# Altium schematic sheet Amplifier_PH.SchDoc
size A4; SheetNumber: 2; SheetTotal: 4
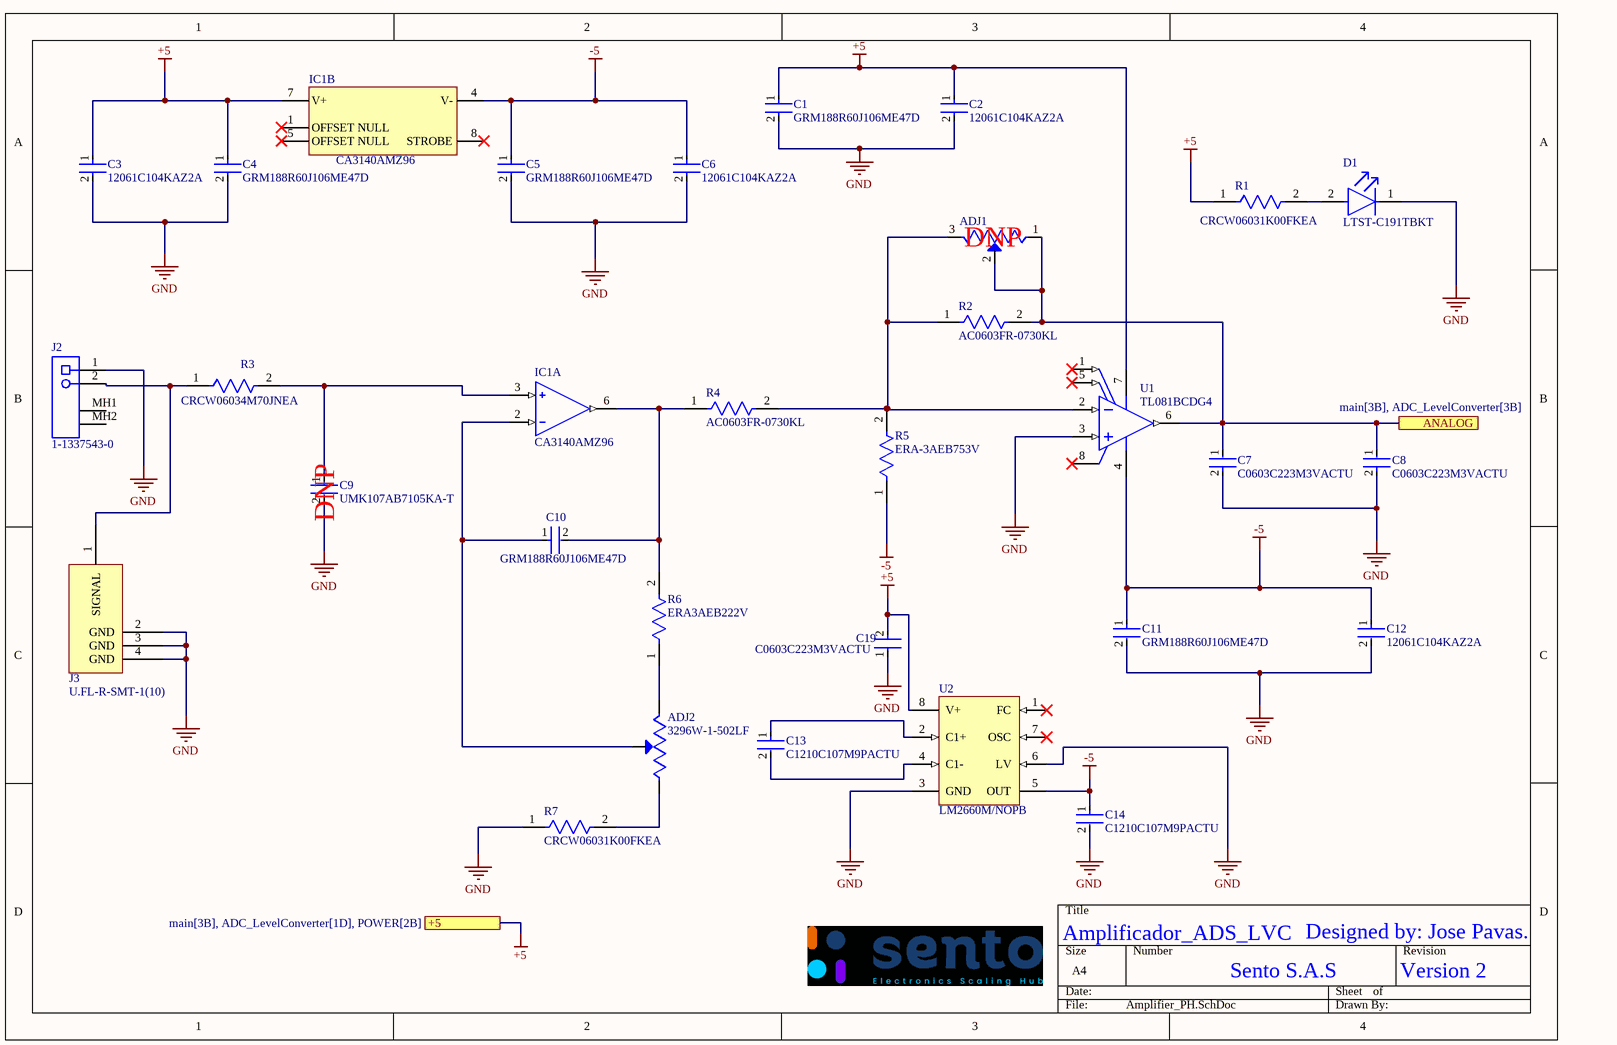
[diagram p0: Amplifier_PH.SchDoc]

## Parts
ADJ1  (no value)  [TRIM_3296W-1-502LF]
ADJ2  3296W-1-502LF  [TRIM_3296W-1-502LF]
C1  GRM188R60J106ME47D  [FP-GRM188-0_1-e0_2_0_55-IPC_A]
C2  12061C104KAZ2A  [FP-1206-L_3_2_0_2-W_1_6_0-MFG]
C3  12061C104KAZ2A  [FP-1206-L_3_2_0_2-W_1_6_0-MFG]
C4  GRM188R60J106ME47D  [FP-GRM188-0_1-e0_2_0_55-IPC_A]
C5  GRM188R60J106ME47D  [FP-GRM188-0_1-e0_2_0_55-IPC_A]
C6  12061C104KAZ2A  [FP-1206-L_3_2_0_2-W_1_6_0-MFG]
C7  C0603C223M3VACTU  [FP-CGA3E-0_3-0_1-MFG]
C8  C0603C223M3VACTU  [FP-CGA3E-0_3-0_1-MFG]
C9  UMK107AB7105KA-T  [FP-0603-L_1_6_0_15-W_0_8-IPC_C]
C10  GRM188R60J106ME47D  [FP-GRM188-0_1-e0_2_0_55-IPC_A]
C11  GRM188R60J106ME47D  [FP-GRM188-0_1-e0_2_0_55-IPC_A]
C12  12061C104KAZ2A  [FP-1206-L_3_2_0_2-W_1_6_0-MFG]
C13  C1210C107M9PACTU  [FP-C1210C107M9PACTU-MFG]
C14  C1210C107M9PACTU  [FP-C1210C107M9PACTU-MFG]
C19  C0603C223M3VACTU  [FP-CGA3E-0_3-0_1-MFG]
D1  LTST-C191TBKT  [FP-LTST-C191TBKT-MFG]
IC1  CA3140AMZ96  [SOIC127P600X175-8N]  (parts A,B of 2)
J2  1-1337543-0  [TECO-1-1337543-0_V]
J3  U.FL-R-SMT-1(10)  [0734120110]
R1  CRCW06031K00FKEA  [FP-CRCW0603-e3-MFG]
R2  AC0603FR-0730KL  [FP-AC0603-IPC_C]
R3  CRCW06034M70JNEA  [FP-CRCW0603-e3-MFG]
R4  AC0603FR-0730KL  [FP-AC0603-IPC_C]
R5  ERA-3AEB753V  [FP-ERA3A-MFG]
R6  ERA3AEB222V  [FP-ERA3A-MFG]
R7  CRCW06031K00FKEA  [FP-CRCW0603-e3-MFG]
U1  TL081BCDG4  [TI-D8_M]
U2  LM2660M/NOPB  [D0008A_M]

## Ports
+5 (see main[3B], ADC_LevelConverter[1D], POWER[2B]), ANALOG (see main[3B], ADC_LevelConverter[3B])

## Nets
+5: C1.1 C2.1 C3.1 C4.1 C19.2 IC1.7(V+) R1.1 U1.7(VCC+) U2.8(V+) ; port +5
-5: C5.1 C6.1 C11.1 C12.1 C14.1 IC1.4(V-) R5.1 U1.4(VCC-) U2.5(OUT)
GND: C1.2 C2.2 C3.2 C4.2 C5.2 C6.2 C7.2 C8.2 C9.2 C11.2 C12.2 C14.2 C19.1 D1.1(C) J2.1 J3.2(GND) J3.3(GND) J3.4(GND) R7.1 U1.3(IN+) U2.3(GND) U2.6(LV)
ANALOG: ADJ1.1(CCW) ADJ1.2(WIPER) C7.1 C8.1 R2.2 U1.6(OUT) ; port ANALOG
NetADJ1_3: ADJ1.3(CW) R2.1 R4.2 R5.2 U1.2(IN-)
NetADJ2_1: ADJ2.1(CCW) R7.2
NetADJ2_2: ADJ2.2(WIPER) C10.1 IC1.2(INV_INPUT)
NetADJ2_3: ADJ2.3(CW) R6.1
NetC9_1: C9.1 IC1.3(NON-INV_INPUT) R3.2
NetC10_2: C10.2 IC1.6(OUTPUT) R4.1 R6.2
NetC13_1: C13.1 U2.2(C1+)
NetC13_2: C13.2 U2.4(C1-)
NetD1_2: D1.2(A) R1.2
NetJ2_2: J2.2 J3.1(SIGNAL) R3.1

Not connected (* = marked no-connect by the designer): IC1 1(OFFSET_NULL)* 5(OFFSET_NULL)* 8(STROBE)*; J2 MH1 MH2; U1 1(OFFSET_N1)* 5(OFFSET_N2)* 8(NC)*; U2 1(FC)* 7(OSC)*

## Notes on the sheet
- (near ADJ1) DNP
- (near C9) DNP
- Amplificador_ADS_LVC
- Sento S.A.S
- Designed by: Jose Pavas.
- Version 2

## Library data of the parts
ADJ1 = 3296W-1-502LF: 100 kOhms 0.5W, 1/2W PC Pins Through Hole Trimmer Potentiometer Cermet 25.0 Turn Top Adjustment; MF: Bourns; Value: 100k; SnapEDA_Link: https://www.snapeda.com/parts/3296W-1-502LF/Bourns/view-part/?ref=snap; MP: 3296W-1-502LF; Price: None; Package: SOT-23-5 Bourns; Check_prices: https://www.snapeda.com/parts/3296W-1-502LF/Bourns/view-part/?ref=eda; Purchase-URL: https://pricing.snapeda.com/search/part/3296W-1-502LF/?ref=eda; Availability: In Stock; ComponentLink1Description: MOUSER; ComponentLink1URL: https://co.mouser.com/ProductDetail/Bourns/3296W-1-104ALF?qs=PYWKc%252BkzmhnUybN0QggnnQ%3D%3D; Supplier 1: Digikey; Supplier Part Number 1: 3296W-502LF-ND; LCSC Part Number: C48084
ADJ2 = 3296W-1-502LF: 5 kOhms 0.5W, 1/2W PC Pins Through Hole Trimmer Potentiometer Cermet 25.0 Turn Top Adjustment; MF: Bourns; Value: 5k; SnapEDA_Link: https://www.snapeda.com/parts/3296W-1-502LF/Bourns/view-part/?ref=snap; MP: 3296W-1-502LF; Price: None; Package: SOT-23-5 Bourns; Check_prices: https://www.snapeda.com/parts/3296W-1-502LF/Bourns/view-part/?ref=eda; Purchase-URL: https://pricing.snapeda.com/search/part/3296W-1-502LF/?ref=eda; Availability: In Stock; ComponentLink1Description: MOUSER; ComponentLink1URL: https://co.mouser.com/ProductDetail/Bourns/3296W-1-502LF?qs=zl1BDXJPZVrTnesl5BcuCQ%3D%3D; Supplier 1: Digikey; Supplier Part Number 1: 3296W-502LF-ND; LCSC Part Number: C60620
C1 C4 C5 C10 C11 = CMP-2006-02792-2: Chip Multilayer Ceramic Capacitors for General Purpose, 0603, 10uF, X5R, 15%, 20%, 6.3V; Packaging: Tape and Reel; Voltage Rating (DC): 6.3V; Width: 0.031inch; Termination: SMD/SMT; Dielectric: X5R; Package Quantity: 4000; Voltage Rating: 6.3V; Capacitance: 10uF; Case/Package: 0603; Min Operating Temperature: -55°C; Voltage: 6.3V; Length: 1.6mm; Thickness: 0.035inch; Lead Free: Lead Free; Depth: 0.8mm; Case Code (Imperial): 0603; Max Operating Temperature: 85°C; Material: Ceramic; Height: 0.8mm; Tolerance: 20%; Mount: Surface Mount; REACH SVHC: No SVHC; Radiation Hardening: No; Case Code (Metric): 1608; LCSC Part Number: C19702
  C1 C4 C5: ComponentLink1Description: MOUSER; ComponentLink1URL: https://co.mouser.com/ProductDetail/Murata-Electronics/GRM188R60J106ME47D?qs=5VWgUag8BO1qcafxYhmP3g%3D%3D
C2 C3 C6 C12 = CMP-04427-004798-1: General Purpose Ceramic Capacitor, 1206, 100nF, 10%, X7R, 15%, 100V; Features: Soft Termination; Termination: SMD/SMT; Mount: Surface Mount; Tolerance: 10%; Voltage Rating: 100V; Length: 3.2mm; Case/Package: 1206; Case Code (Metric): 3216; RoHS Compliant: Yes; Package Quantity: 1; Max Operating Temperature: 125°C; Voltage Rating (DC): 100V; Min Operating Temperature: -55°C; Number of Pins: 2; Packaging: Tape and Reel; Width: 0.063inch; REACH SVHC: No SVHC; Lead Free: Lead Free; Construction: Flat; Capacitance: 100nF; Radiation Hardening: No; Case Code (Imperial): 1206; Thickness: 0.05inch; Series: FLEXITERM®; Depth: 1.6mm; Dielectric: X7R; ComponentLink1Description: MOUSER; ComponentLink1URL: https://co.mouser.com/ProductDetail/KYOCERA-AVX/12061C104KAZ2A?qs=DFzMtgyOV7er0SHzcpdifw%3D%3D; LCSC Part Number: C726629
C7 C8 C19 = CMP-2000-07546-2: Cap Ceramic 100nF 50V X7R 10% Pad SMD 0603 +125°C Automotive T/R; Weight: 7.1E-05oz; Composition: Ceramic; Max Operating Temperature: 125°C; Termination: SMD/SMT; Dielectric: X7R; Length: 1.6mm; Package Quantity: 1; REACH SVHC: No SVHC; Lead Free: Lead Free; Case Code (Metric): 1608; Min Operating Temperature: -55°C; Packaging: Tape and Reel; Tolerance: 10%; Voltage Rating: 50V; Case Code (Imperial): 0603; Capacitance: 100nF; Case/Package: 0603; Voltage Rating (DC): 50V; Depth: 0.8mm; Radiation Hardening: No; Ratings: AEC-Q200; Mount: Surface Mount; Voltage: 50V; Thickness: 0.035inch; Width: 0.8mm; Height: 0.8mm; LCSC Part Number: C1591
C9 = CMP-2000-07531-4: Ceramic Capacitor General Use 1uF ±10% 50V X7R 0603; Series: M; Width: 0.031inch; Mount: Surface Mount; Radiation Hardening: No; Voltage Rating (DC): 50V; Packaging: Tape and Reel; Termination: SMD/SMT; Depth: 0.8mm; Case Code (Metric): 1608; Case Code (Imperial): 0603; Height: 0.8mm; Voltage Rating: 50V; Package Quantity: 1; Halogen Free: Halogen Free; Dielectric: X7R; Min Operating Temperature: -55°C; Length: 1.6mm; Construction: Flat; Tolerance: 10%; Thickness: 0.037inch; Max Operating Temperature: 125°C; Case/Package: 0603; Capacitance: 1uF; RoHS Compliant: Yes; LCSC Part Number: C15849
C13 C14 = CMP-2000-06018-2: CAP CER 100UF 6.3V X5R 1210; Dissipation Factor: 5%; Dielectric Material: Ceramic; Tolerance: 20%; Termination: SMD/SMT; REACH SVHC: No SVHC; Thickness: 0.11inch; Packaging: Tape and Reel; Series: C; Width: 2.5mm; Voltage Rating (DC): 6.3V; Voltage: 6.3V; Contact Plating: Tin; Package Quantity: 1; Case/Package: 1210; Min Operating Temperature: -55°C; Height: 2.5mm; Radiation Hardening: No; Capacitance: 100uF; Case Code (Metric): 3225; Depth: 2.5mm; Construction: Flat; Max Operating Temperature: 85°C; Number of Pins: 2; Mount: Surface Mount; Lead Free: Lead Free; RoHS Compliant: Yes; Voltage Rating: 6.3V; Dielectric: X5R; Length: 3.2mm; Case Code (Imperial): 1210; LCSC Part Number: C23742
D1 = CMP-22017-000008-1: LED BLUE CLEAR CHIP SMD; Lens Color: Colorless; Dominant Wavelength: 475nm; Forward Current: 20mA; Wavelength: 468nm; Viewing Angle: 130°; Power Dissipation: 76mW; Luminous Intensity: 180mcd; Reverse Voltage: 5V; Number of Elements: 1; Lens Style: Diffused; Forward Voltage: 3.8V; Max Power Dissipation: 75mW; Case Code (Metric): 1608; Packaging: Tape and Reel; Case/Package: 0603; Depth: 1.6mm; Mount: Surface Mount; Lead Free: Lead Free; Min Operating Temperature: -20°C; Lens Transparency: Clear; Illumination Color: Blue; Height: 0.55mm; Test Current: 20mA; Case Code (Imperial): 0603; Max Operating Temperature: 80°C; Number of Pins: 2; Length: 0.8mm; Radiation Hardening: No; Package Quantity: 1; Number of LEDs: 1; Width: 0.8mm; Color: Blue; ComponentLink1Description: MOUSER; ComponentLink1URL: https://co.mouser.com/ProductDetail/Lite-On/LTST-C191TBKT?qs=dmW16TmpDgF%252B6HWuTmCtcw%3D%3D; LCSC Part Number: C99290
IC1 = CMP-00572-88253531-1: CA3140AMZ96 CA3140 Series 36 V 4.5 MHz BiMOS Operational Amplifier - SOIC-8; Bandwidth: 4.5MHz; Slew Rate: 9V/µs; Packaging: Cut Tape; NexarPartId: 88253531; RoHS: Compliant; ComponentLink1Description: MOUSER; ComponentLink1URL: https://co.mouser.com/ProductDetail/Renesas-Intersil/CA3140AMZ?qs=sGAEpiMZZMutXGli8Ay4kA%2FBPd2gF8jLlzpVi%252BTKdUc%3D; LCSC Part Number: C31540
J2 = CMP-2000-05853-1: Female Connector, Pitch 2.54 mm, 1 x 2 Position, Height 15.8 mm, Tail Length 3.8 mm, / -55 to 85 degC, RoHS, Bulk; Manufacturer: TE Connectivity; Connector Body Style: RightAngleJack; Frequency Max: 4GHz; Coaxial Termination: Solder; Connector Mounting: PCBMount; SVHC: ToBeAdvised; Connector Type: BNCCoaxial; Impedance: 50ohm; Coaxial Cable Types: -; Manufacturer URL: http://www.te.com/; Package Reference: 1-1337543-0; Product Range: -; Datasheet URL: http://www.te.com/commerce/DocumentDelivery/DDEController?Action=showdoc&DocId=Customer+Drawing%7F1337543%7FG%7Fpdf%7FEnglish%7FENG_CD_1337543_G.pdf%7F1-1337543-0; Contact Plating: GoldPlatedContacts; Mounting Technology: ThroughHole; Package Description: Female Connector, Pitch 2.54 mm, 1 x 2 Position, Height 15.8 mm, Tail Length 3.8 mm; Contact Material: Brass; Datasheet Version: Rev. G, 12/2012; ComponentLink1Description: MOUSER; ComponentLink1URL: https://co.mouser.com/ProductDetail/TE-Connectivity-AMP/1-1337543-0?qs=C39VGJgkyqP7s5Z2V1r6VA%3D%3D; LCSC Part Number: C2837588
J3 = 0734120110: CONN UMC RCPT STR 50 OHM SMD; Manufacturer: Molex, LLC; Connector Style: Ultra Miniature Coaxial; Connector Type: Receptacle, Male Pin; Contact Termination: Solder; Impedance: 50 Ohm; Body Material: Phosphor Bronze; Body Finish: Nickel; Center Contact Plating: Gold; Dielectric Material: Liquid Crystal Polymer (LCP); Center Contact Material: Brass; Mating Cycles: 30; Supplier 1: Digi-Key; Manufacturer Part Number: 0734120110; RoHS: RoHS Compliant; Category: Connectors, Interconnects; Stock 1: 48500; Pricing 1: 1=0.73, 10=0.688, 25=0.6188, 50=0.5502, 100=0.5273, 250=0.4814, 500=0.45848, 1000=0.37825, 2500=0.34386 (USD); Packaging: Cut Tape (CT); Part Status: Active; Shield Termination: Solder; Mounting Type: Surface Mount; Mounting Feature: -; Cable Group: -; Fastening Type: Snap-On; Features: -; Housing Color: Silver; Ingress Protection: -; Includes: -; Operating Temperature: -40°C ~ 90°C; Insertion Loss: -; ComponentLink1URL: http://www.molex.com/pdm_docs/sd/734120110_sd.pdf; ComponentLink1Description: http://www.molex.com/pdm_docs/sd/734120110_sd.pdf; Supplier Part Number 1: WM5587CT-ND; LCSC Part Number: C88374
R1 R7 = CMP-1666-00003-5: RES Thick Film, 1kΩ, 1%, 0.1W, 100ppm/°C, 0603; Max Power Dissipation: 100mW; Voltage Rating: 75V; Resistance: 1kR; Max Operating Temperature: 155°C; Number of Pins: 2; Case Code (Imperial): 0603; Width: 0.033inch; Power Rating: 100mW; Number of Terminations: 2; Package Quantity: 10; Weight: 7.1E-05oz; Tolerance: 1%; Temperature Coefficient: 100ppm/°C; Military Standard: Not; Mount: Surface Mount; Voltage Rating (DC): 75V; Depth: 0.85mm; Composition: Thick Film; Radiation Hardening: No; Termination: SMD/SMT; Length: 1.55mm; Case Code (Metric): 1608; Contact Plating: Tin; Min Operating Temperature: -55°C; Packaging: Tape and Reel; Height: 0.45mm; Lead Free: Lead Free; Case/Package: 0603; Features: Automotive AEC-Q200; ComponentLink1Description: MOUSER; LCSC Part Number: C22548
  R1: ComponentLink1URL: https://co.mouser.com/ProductDetail/Vishay-Dale/CRCW06031K00FKEA?qs=CToX950LohJasujQx7GY3g%3D%3D
  R7: ComponentLink1URL: CRCW06031K00FKEA
R2 R4 = CMP-03412-024732-2: RES 30KΩ 1.00% 0.1W 0603; Resistance: 30kR; Tolerance: 1%; Power Rating: 100mW; Temperature Coefficient: 100ppm/°C; Voltage Rating: 50V; Number of Terminations: 2; Series: AC; Packaging: Tape and Reel; Resistor Type: Thick Film; Min Operating Temperature: -55°C; Case Code (Imperial): 0603; Termination: SMD/SMT; Max Operating Temperature: 155°C; Ratings: AEC-Q200; Case Code (Metric): 1608; Features: Moisture Resistant; Case/Package: 0603; Max Power Dissipation: 100mW; Width: 0.8mm; Height: 0.45mm; Length: 1.6mm; ComponentLink1Description: MOUSER; ComponentLink1URL: https://co.mouser.com/ProductDetail/YAGEO/AC0603FR-0730KL?qs=yhV1fb9g%2FKYTcglclJn56g%3D%3D; LCSC Part Number: C113302
R3 = CMP-2000-03426-2: RES Thick Film, 4.7MΩ, 5%, 0.1W, 200ppm/°C, 0603; Voltage Rating (DC): 75V; Resistance: 4.7MR; Power Rating: 100mW; Features: Automotive AEC-Q200; Number of Terminations: 2; Case Code (Metric): 1608; Case/Package: 0603; Composition: Thick Film; Min Operating Temperature: -55°C; Tolerance: 5%; Height: 0.45mm; Width: 0.033inch; Depth: 0.85mm; Length: 1.55mm; Military Standard: Not; Case Code (Imperial): 0603; Radiation Hardening: No; Temperature Coefficient: 200ppm/°C; Weight: 7.1E-05oz; Number of Pins: 2; Voltage Rating: 75V; Termination: Solder; Contact Plating: Tin; Package Quantity: 1; Max Operating Temperature: 155°C; Lead Free: Lead Free; Packaging: Tape and Reel; Max Power Dissipation: 100mW; ComponentLink1Description: MOUSER; ComponentLink1URL: https://co.mouser.com/ProductDetail/Vishay-Dale/CRCW06034M70JNEAC?qs=E3Y5ESvWgWPbc3YKTOCygQ%3D%3D; LCSC Part Number: C227938
R5 = CMP-2000-00124-2: RES SMD 75K OHM 0.1% 1/10W 0603; Manufacturer: Panasonic; Voltage Rating: 75V; Resistance: 75kΩ; Power Rating: 0.1W; Automotive Grade: Grade 0; Value: 75kΩ; Temperature Coefficient: 25ppm/°C; Ipc Land Pattern Name: RESC16080X45; Device Class L3: Chip SMD Resistors; Composition: Metal Film; Footprint Url: https://industrial.panasonic.com/cdbs/www-data/pdf/RDM0000/DMM0000COL17.pdf; Temperature: -55°C to +155°C; Automotive: Yes; Lead Free: Yes; Device Class L2: Resistors; Package: ERA3A; Octopart: https://octopart.com/era-3aeb753v-panasonic-1225046; Device Class L1: Passive Components; ComponentLink2Description: Datasheet; Temperature Range Low: -55°C; Series: ERA; ComponentLink2URL: https://industrial.panasonic.com/cdbs/www-data/pdf/RDM0000/AOA0000C307.pdf; Manufacturer Part Number: ERA-3AEB753V; RoHS: TRUE; Temperature Range High: +155°C; Category: Res; Height: 0.55mm; Digikey Description: RES SMD 75K OHM 0.1% 1/10W 0603; Tolerance: 0.1%; Mouser Description: Thin Film Resistors - SMD 0603 1/10W 75Kohms; ComponentLink3Description: MOUSER; ComponentLink3URL: https://co.mouser.com/ProductDetail/Panasonic/ERA-3AEB753V?qs=XhO1W%252B5LdJ8bZAal2NqsiA%3D%3D; LCSC Part Number: C855956
R6 = CMP-2000-00955-7: RES SMD 2.2K OHM 0.1% 1/10W 0603; Power Rating: 100mW; Resistance: 2.2kR; Voltage Rating (DC): 75V; Temperature Coefficient: 25ppm/°C; Case/Package: 0603; Number of Pins: 2; Length: 1.6mm; Width: 0.8mm; RoHS Compliant: Yes; Lead Free: Lead Free; Radiation Hardening: No; Mount: Surface Mount; Max Power Dissipation: 100mW; Package Quantity: 5000; Height: 0.45mm; Series: ERA-3A; Reach SVHC Compliant: Yes; Features: Automotive AEC-Q200; Case Code (Imperial): 0603; Packaging: Tape and Reel; Construction: Rectangular; Case Code (Metric): 1608; Technology: METAL FILM; Ratings: AEC-Q200; Termination: SMD/SMT; Max Operating Temperature: 155°C; Depth: 0.8mm; Resistor Type: Thin Film; Tolerance: 0.1%; Military Standard: Not; Resistance Tolerance: 0.1%; Contact Plating: Tin; Number of Terminations: 2; Min Operating Temperature: -55°C; Size Code: 0603; Voltage Rating: 75V; ComponentLink1Description: MOUSER; ComponentLink1URL: https://co.mouser.com/ProductDetail/Panasonic/ERA-3AEB222V?qs=1VWA5LkbEaoeuphfROnEEQ%3D%3D; LCSC Part Number: C858962
U1 = CMP-0017-00388-1: JFET-Input Operational Amplifier, 7 to 36 V, 0 to 70 degC, 8-pin SOIC (D8), Green (RoHS & no Sb/Br); Manufacturer: Texas Instruments; GBW(Typ)(MHz): 3; Offset Drift(Typ)(uV/C): 18; Total Supply Voltage(Max)(+5V is 5, +/-5V is 10): 36; Slew Rate(Typ)(V/us): 13; CMRR(Min)(dB): 75; Sub Family: General Purpose Amplifier, High Supply Voltage Amplifier (>=30V); Iq per channel(Max)(mA): 2.8; IIB(Max)(pA): 200; Total Supply Voltage(Min)(+5V is 5, +/-5V is 10): 7; Rating: Catalog; Number of Channels: 1; ComponentLink1URL: http://www.ti.com/; Vn at 1kHz(Typ)(nV/rtHz): 18; ComponentLink2Description: Datasheet; ComponentLink1Description: Manufacturer URL; Eco-Plan: Green (RoHS & no Sb/Br); PackageReference: D8; PartNumber: TL081BCDG4; ComponentLink3URL: http://www.ti.com/litv/pdf/msoi002j; Code_JEDEC: MS-012; DatasheetVersion: SLOS081G; ComponentLink2URL: http://www.ti.com/lit/ds/symlink/tl081b.pdf; ComponentLink3Description: Package Specification; PackageDescription: 8-Pin Plastic Small Outline, Body 4.9 x 3.9 mm, Pitch 1.27 mm; PackageVersion: 4040047-3/M, 06/2011; Mounting Technology: Surface Mount; Vio (25C)(Max)(mV): 3; ComponentLink4Description: MOUSER; ComponentLink4URL: https://co.mouser.com/ProductDetail/Texas-Instruments/TL081BCD?qs=odmYgEirbwwOtgI7tvPDqA%3D%3D; LCSC Part Number: C4370484
U2 = CMP-0065-00027-3: Switched Capacitor Voltage Converter, 8-pin Narrow SOIC, Pb-Free; Manufacturer: Texas Instruments; PackageTopMarking: NSZXTT*LM26*60M; CompType: Switch Caps; PowerWise: N; PackageDescription: SOIC Narrow, 4.9 x 3.9 x 1.45mm, 8 Lead, 1.27mm Pitch; RoHS: Y; ComponentLink1URL: http://www.ti.com/general/docs/lit/getliterature.tsp?genericPartNumber=LM2660&fileType=pdf; Code_JEDEC: MS-012-AA; ComponentLink1Description: Datasheet URL; PackageReference: D0008A; PinCount: 8; Code_IPC: SOIC127P600-8; LCSC Part Number: C183083